# EAGLE schematic elasticNode (EAGLE 8.2.0)

## Sheet 1 of 4
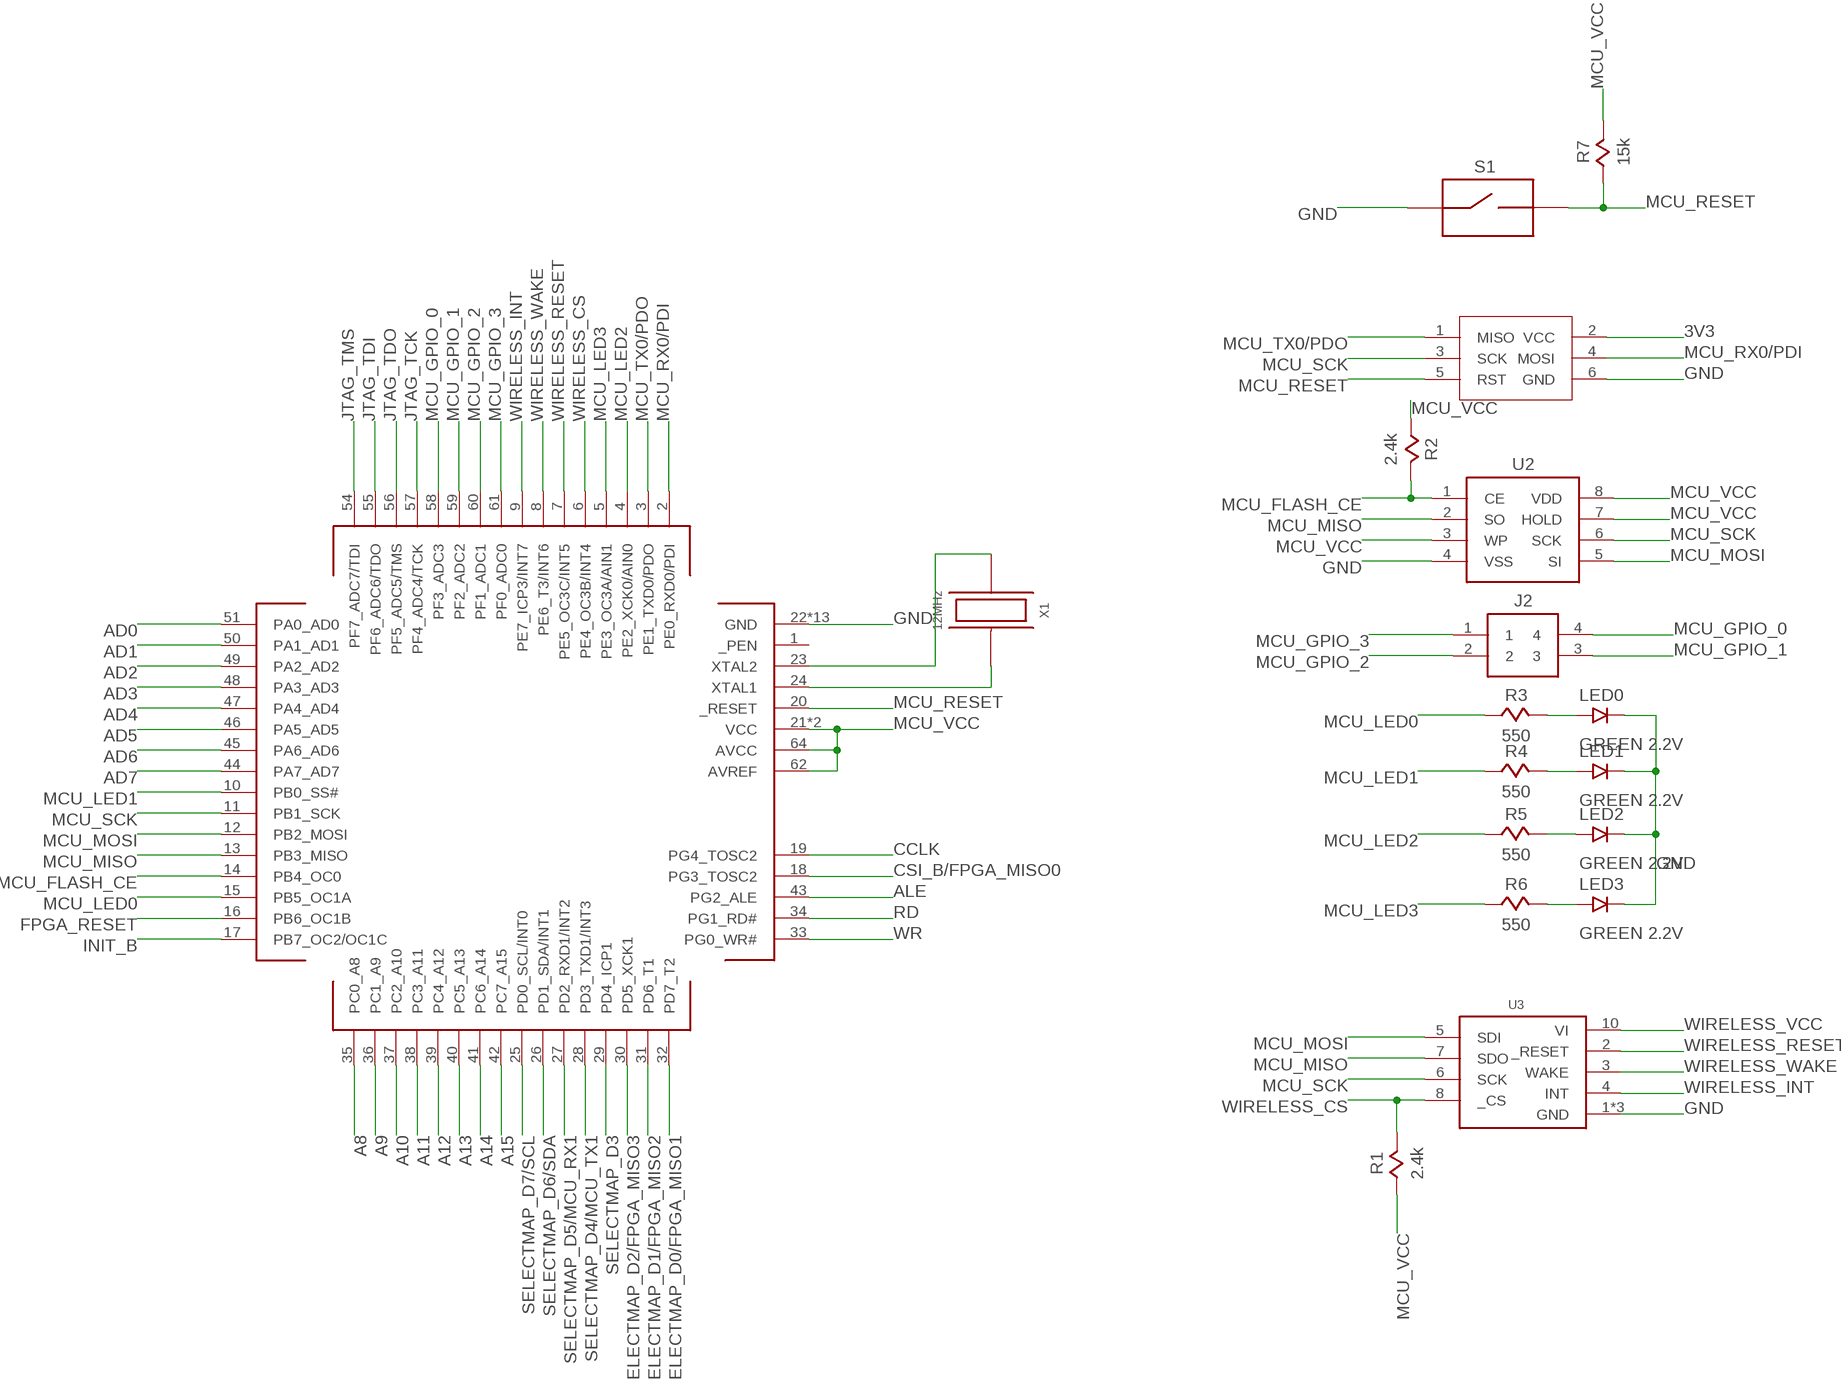
[diagram p0: schematic, sheet 1]

### Parts
J1  ISP_CONN_6PIN  [3X2_HEADER_SMT]
J2  FEMALE_HEADER_2X2  [2X2_HEADER]
LED0  GREEN 2.2V  LED  [0805]
LED1  GREEN 2.2V  LED  [0805]
LED2  GREEN 2.2V  LED  [0805]
LED3  GREEN 2.2V  LED  [0805]
R1  2.4k  RESISTOR  [0805]
R2  2.4k  RESISTOR  [0805]
R3  550  RESISTOR  [0805]
R4  550  RESISTOR  [0805]
R5  550  RESISTOR  [0805]
R6  550  RESISTOR  [0805]
R7  15k  RESISTOR  [0805]
S1  SPST_BUTTON2PIN_SMT  [SPST_2PIN_SMT]
U1  ATMEGA64AQFN  [QFN64]
U2  SST26VF032B  [SOIC8]
U3  MRF24J40MA  [MRF24J40MA]
X1  12MHz  QUARTZ  [3.2X2.5_OSC]

### Nets
3V3 [power]: J1.2(VCC) ; also sheet 2,3,4
A8: U1.35(PC0_A8) ; also sheet 2
A9: U1.36(PC1_A9) ; also sheet 2
A10: U1.37(PC2_A10) ; also sheet 2
A11: U1.38(PC3_A11) ; also sheet 2
A12: U1.39(PC4_A12) ; also sheet 2
A13: U1.40(PC5_A13) ; also sheet 2
A14: U1.41(PC6_A14) ; also sheet 2
A15: U1.42(PC7_A15) ; also sheet 2
AD0: U1.51(PA0_AD0) ; also sheet 2
AD1: U1.50(PA1_AD1) ; also sheet 2
AD2: U1.49(PA2_AD2) ; also sheet 2
AD3: U1.48(PA3_AD3) ; also sheet 2
AD4: U1.47(PA4_AD4) ; also sheet 2
AD5: U1.46(PA5_AD5) ; also sheet 2
AD6: U1.45(PA6_AD6) ; also sheet 2
AD7: U1.44(PA7_AD7) ; also sheet 2
ALE: U1.43(PG2_ALE) ; also sheet 2
CCLK: U1.19(PG4_TOSC2) ; also sheet 2
CSI_B/FPGA_MISO0: U1.18(PG3_TOSC2) ; also sheet 2
FPGA_RESET: U1.16(PB6_OC1B) ; also sheet 2
GND: J1.6(GND) LED0.2 LED1.2 LED2.2 LED3.2 S1.1 U1.22(GND) U1.53(GND) U1.63(GND) U1.PAD(GND) U1.VIA1(GND) U1.VIA2(GND) U1.VIA3(GND) U1.VIA4(GND) U1.VIA5(GND) U1.VIA6(GND) U1.VIA7(GND) U1.VIA8(GND) U1.VIA9(GND) U2.4(VSS) U3.1(GND) U3.11(GND) U3.12(GND) ; also sheet 2,3,4
INIT_B: U1.17(PB7_OC2/OC1C) ; also sheet 2
JTAG_TCK: U1.57(PF4_ADC4/TCK) ; also sheet 2
JTAG_TDI: U1.55(PF6_ADC6/TDO) ; also sheet 2
JTAG_TDO: U1.56(PF5_ADC5/TMS) ; also sheet 2
JTAG_TMS: U1.54(PF7_ADC7/TDI) ; also sheet 2
MCU_FLASH_CE: R2.2 U1.14(PB4_OC0) U2.1(CE)
MCU_GPIO_0: J2.4 U1.58(PF3_ADC3)
MCU_GPIO_1: J2.3 U1.59(PF2_ADC2)
MCU_GPIO_2: J2.2 U1.60(PF1_ADC1)
MCU_GPIO_3: J2.1 U1.61(PF0_ADC0)
MCU_LED0: R3.1 U1.15(PB5_OC1A)
MCU_LED1: R4.1 U1.10(PB0_SS#)
MCU_LED2: R5.1 U1.4(PE2_XCK0/AIN0)
MCU_LED3: R6.1 U1.5(PE3_OC3A/AIN1)
MCU_MISO: U1.13(PB3_MISO) U2.2(SO) U3.7(SDO)
MCU_MOSI: U1.12(PB2_MOSI) U2.5(SI) U3.5(SDI)
MCU_RESET: J1.5(RST) R7.1 S1.2 U1.20(_RESET)
MCU_RX0/PDI: J1.4(MOSI) U1.2(PE0_RXD0/PDI) ; also sheet 4
MCU_SCK: J1.3(SCK) U1.11(PB1_SCK) U2.6(SCK) U3.6(SCK)
MCU_TX0/PDO: J1.1(MISO) U1.3(PE1_TXD0/PDO) ; also sheet 4
MCU_VCC: R1.1 R2.1 R7.2 U1.21(VCC) U1.52(VCC) U1.62(AVREF) U1.64(AVCC) U2.3(WP) U2.7(HOLD) U2.8(VDD) ; also sheet 3
N$13: LED3.1 R6.2
N$15: LED2.1 R5.2
N$23: LED1.1 R4.2
N$24: LED0.1 R3.2
RD: U1.34(PG1_RD#) ; also sheet 2
SELECTMAP_D0/FPGA_MISO1: U1.32(PD7_T2) ; also sheet 2
SELECTMAP_D1/FPGA_MISO2: U1.31(PD6_T1) ; also sheet 2
SELECTMAP_D2/FPGA_MISO3: U1.30(PD5_XCK1) ; also sheet 2
SELECTMAP_D3: U1.29(PD4_ICP1) ; also sheet 2
SELECTMAP_D4/MCU_TX1: U1.28(PD3_TXD1/INT3) ; also sheet 2
SELECTMAP_D5/MCU_RX1: U1.27(PD2_RXD1/INT2) ; also sheet 2
SELECTMAP_D6/SDA: U1.26(PD1_SDA/INT1) ; also sheet 2,3
SELECTMAP_D7/SCL: U1.25(PD0_SCL/INT0) ; also sheet 2,3
WIRELESS_CS: R1.2 U1.6(PE4_OC3B/INT4) U3.8(_CS)
WIRELESS_INT: U1.9(PE7_ICP3/INT7) U3.4(INT)
WIRELESS_RESET: U1.7(PE5_OC3C/INT5) U3.2(_RESET)
WIRELESS_VCC [power]: U3.10(VI) ; also sheet 3
WIRELESS_WAKE: U1.8(PE6_T3/INT6) U3.3(WAKE)
WR: U1.33(PG0_WR#) ; also sheet 2
XTAL1: U1.24(XTAL1) X1.3
XTAL2: U1.23(XTAL2) X1.1
Unconnected: U1.1(_PEN)

## Sheet 2 of 4
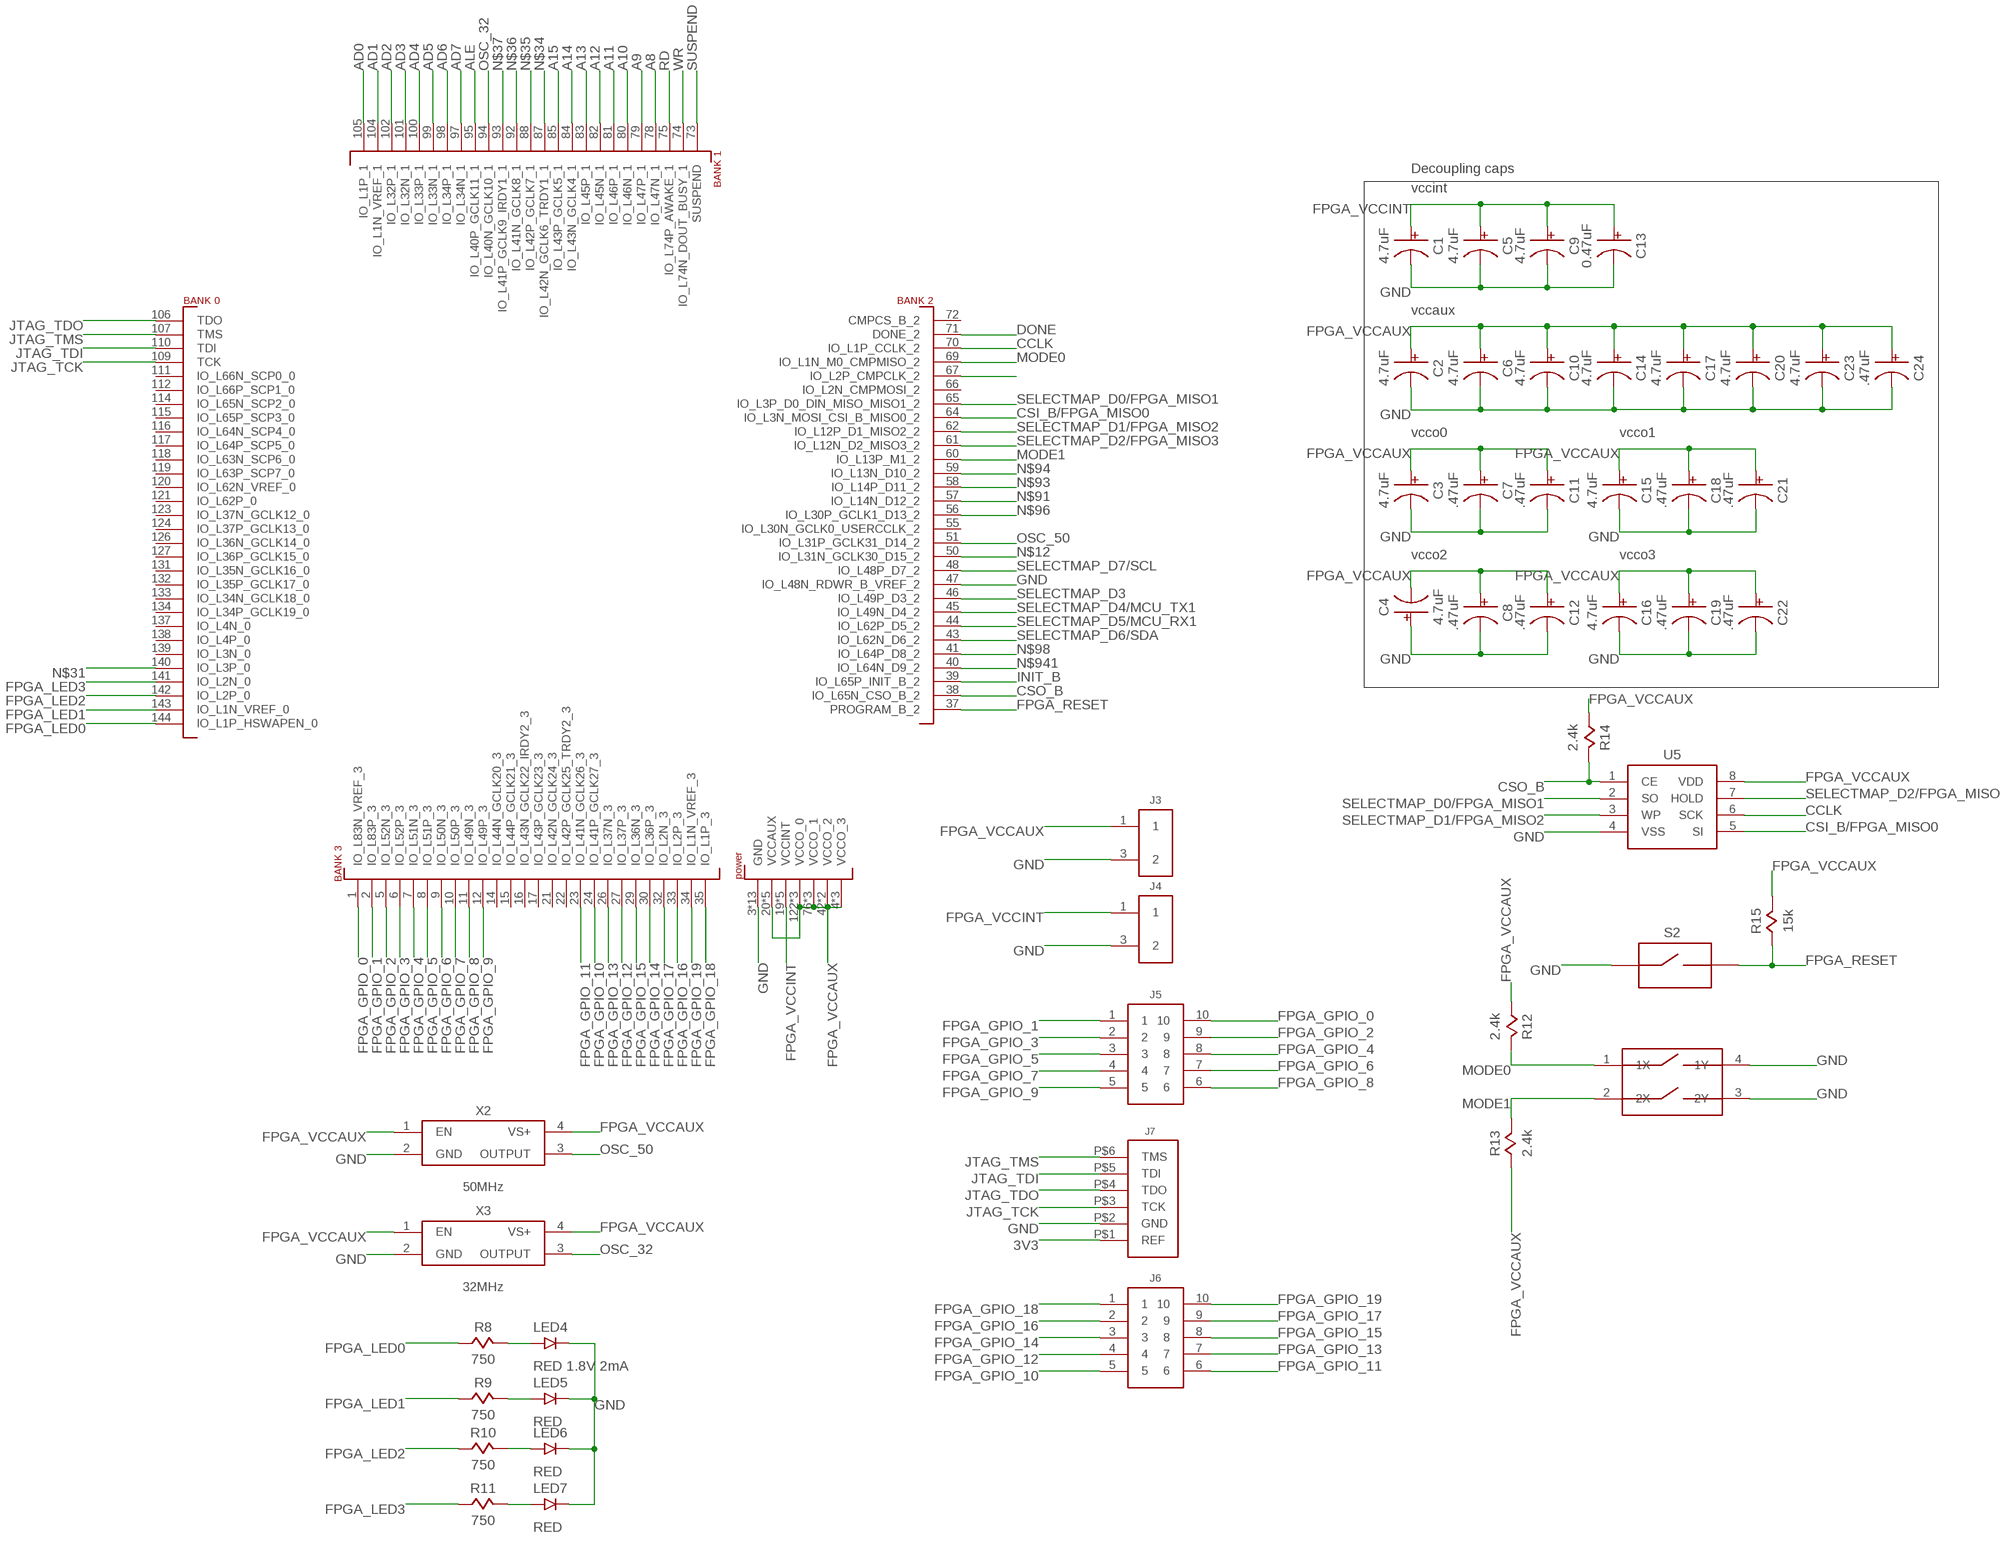
[diagram p1: schematic, sheet 2]

### Parts
C1  4.7uF  CAPACITOR0805  [0805]
C2  4.7uF  CAPACITOR0805  [0805]
C3  4.7uF  CAPACITOR0805  [0805]
C4  4.7uF  CAPACITOR0805  [0805]
C5  4.7uF  CAPACITOR0805  [0805]
C6  4.7uF  CAPACITOR0805  [0805]
C7  .47uF  CAPACITOR0402  [0402]
C8  .47uF  CAPACITOR0402  [0402]
C9  4.7uF  CAPACITOR0805  [0805]
C10  4.7uF  CAPACITOR0805  [0805]
C11  .47uF  CAPACITOR0402  [0402]
C12  .47uF  CAPACITOR0402  [0402]
C13  0.47uF  CAPACITOR0402  [0402]
C14  4.7uF  CAPACITOR0805  [0805]
C15  4.7uF  CAPACITOR0805  [0805]
C16  4.7uF  CAPACITOR0805  [0805]
C17  4.7uF  CAPACITOR0805  [0805]
C18  .47uF  CAPACITOR0402  [0402]
C19  .47uF  CAPACITOR0402  [0402]
C20  4.7uF  CAPACITOR0805  [0805]
C21  .47uF  CAPACITOR0402  [0402]
C22  .47uF  CAPACITOR0402  [0402]
C23  4.7uF  CAPACITOR0805  [0805]
C24  .47uF  CAPACITOR0805  [0805]
J3  FEMALE_HEADER_2X1  [2X1_HEADER]
J4  FEMALE_HEADER_2X1  [2X1_HEADER]
J5  FEMALE_HEADER_5X2  [5X2_HEADER]
J6  FEMALE_HEADER_5X2  [5X2_HEADER]
J7  JTAG_CONN_6PINTHT  [6X1_HEADER]
LED4  RED 1.8V 2mA  LED  [0805]
LED5  RED  LED  [0805]
LED6  RED  LED  [0805]
LED7  RED  LED  [0805]
R8  750  RESISTOR  [0805]
R9  750  RESISTOR  [0805]
R10  750  RESISTOR  [0805]
R11  750  RESISTOR  [0805]
R12  2.4k  RESISTOR  [0805]
R13  2.4k  RESISTOR  [0805]
R14  2.4k  RESISTOR  [0805]
R15  15k  RESISTOR  [0805]
S2  SPST_BUTTON2PIN_SMT  [SPST_2PIN_SMT]
S3  SPST_DIP_2SMT  [SPST_DIP2_SMT]
U4  SPARTAN6-LX9  [TQG144]
U5  SST26VF032B  [SOIC8]
X2  50MHz  OSCILLATOR3.2X2.5  [3.2X2.5_OSC]
X3  32MHz  OSCILLATOR3.2X2.5  [3.2X2.5_OSC]

### Nets
3V3 [power]: J7.P$1(REF) ; also sheet 1,3,4
A8: U4.78(IO_L47N_1) ; also sheet 1
A9: U4.79(IO_L47P_1) ; also sheet 1
A10: U4.80(IO_L46N_1) ; also sheet 1
A11: U4.81(IO_L46P_1) ; also sheet 1
A12: U4.82(IO_L45N_1) ; also sheet 1
A13: U4.83(IO_L45P_1) ; also sheet 1
A14: U4.84(IO_L43N_GCLK4_1) ; also sheet 1
A15: U4.85(IO_L43P_GCLK5_1) ; also sheet 1
AD0: U4.105(IO_L1P_1) ; also sheet 1
AD1: U4.104(IO_L1N_VREF_1) ; also sheet 1
AD2: U4.102(IO_L32P_1) ; also sheet 1
AD3: U4.101(IO_L32N_1) ; also sheet 1
AD4: U4.100(IO_L33P_1) ; also sheet 1
AD5: U4.99(IO_L33N_1) ; also sheet 1
AD6: U4.98(IO_L34P_1) ; also sheet 1
AD7: U4.97(IO_L34N_1) ; also sheet 1
ALE: U4.95(IO_L40P_GCLK11_1) ; also sheet 1
CCLK: U4.70(IO_L1P_CCLK_2) U5.6(SCK) ; also sheet 1
CSI_B/FPGA_MISO0: U4.64(IO_L3N_MOSI_CSI_B_MISO0_2) U5.5(SI) ; also sheet 1
CSO_B: R14.2 U4.38(IO_L65N_CSO_B_2) U5.1(CE)
DONE: U4.71(DONE_2)
FPGA_GPIO_0: J5.10 U4.1(IO_L83N_VREF_3)
FPGA_GPIO_1: J5.1 U4.2(IO_L83P_3)
FPGA_GPIO_2: J5.9 U4.5(IO_L52N_3)
FPGA_GPIO_3: J5.2 U4.6(IO_L52P_3)
FPGA_GPIO_4: J5.8 U4.7(IO_L51N_3)
FPGA_GPIO_5: J5.3 U4.8(IO_L51P_3)
FPGA_GPIO_6: J5.7 U4.9(IO_L50N_3)
FPGA_GPIO_7: J5.4 U4.10(IO_L50P_3)
FPGA_GPIO_8: J5.6 U4.11(IO_L49N_3)
FPGA_GPIO_9: J5.5 U4.12(IO_L49P_3)
FPGA_GPIO_10: J6.5 U4.24(IO_L41P_GCLK27_3)
FPGA_GPIO_11: J6.6 U4.23(IO_L41N_GCLK26_3)
FPGA_GPIO_12: J6.4 U4.27(IO_L37P_3)
FPGA_GPIO_13: J6.7 U4.26(IO_L37N_3)
FPGA_GPIO_14: J6.3 U4.30(IO_L36P_3)
FPGA_GPIO_15: J6.8 U4.29(IO_L36N_3)
FPGA_GPIO_16: J6.2 U4.33(IO_L2P_3)
FPGA_GPIO_17: J6.9 U4.32(IO_L2N_3)
FPGA_GPIO_18: J6.1 U4.35(IO_L1P_3)
FPGA_GPIO_19: J6.10 U4.34(IO_L1N_VREF_3)
FPGA_LED0: R8.1 U4.144(IO_L1P_HSWAPEN_0)
FPGA_LED1: R9.1 U4.143(IO_L1N_VREF_0)
FPGA_LED2: R10.1 U4.142(IO_L2P_0)
FPGA_LED3: R11.1 U4.141(IO_L2N_0)
FPGA_RESET: R15.1 S2.2 U4.37(PROGRAM_B_2) ; also sheet 1
FPGA_VCCAUX: C2.1 C3.1 C4.2 C6.1 C7.1 C8.1 C10.1 C11.1 C12.1 C14.1 C15.1 C16.1 C17.1 C18.1 C19.1 C20.1 C21.1 C22.1 C23.1 C24.1 J3.1 R12.1 R13.1 R14.1 R15.2 U4.4(VCCO_3) U4.18(VCCO_3) U4.20(VCCAUX) U4.31(VCCO_3) U4.36(VCCAUX) U4.42(VCCO_2) U4.53(VCCAUX) U4.63(VCCO_2) U4.76(VCCO_1) U4.86(VCCO_1) U4.90(VCCAUX) U4.103(VCCO_1) U4.122(VCCO_0) U4.125(VCCO_0) U4.129(VCCAUX) U4.135(VCCO_0) U5.8(VDD) X2.1(EN) X2.4(VS+) X3.1(EN) X3.4(VS+) ; also sheet 3
FPGA_VCCINT [power]: C1.1 C5.1 C9.1 C13.1 J4.1 U4.19(VCCINT) U4.28(VCCINT) U4.52(VCCINT) U4.89(VCCINT) U4.128(VCCINT) ; also sheet 3
GND: C1.2 C2.2 C3.2 C4.1 C5.2 C6.2 C7.2 C8.2 C9.2 C10.2 C11.2 C12.2 C13.2 C14.2 C15.2 C16.2 C17.2 C18.2 C19.2 C20.2 C21.2 C22.2 C23.2 C24.2 J3.3 J4.3 J7.P$2(GND) LED4.2 LED5.2 LED6.2 LED7.2 S2.1 S3.3(2Y) S3.4(1Y) U4.3(GND) U4.13(GND) U4.25(GND) U4.47(IO_L48N_RDWR_B_VREF_2) U4.49(GND) U4.54(GND) U4.68(GND) U4.77(GND) U4.91(GND) U4.96(GND) U4.108(GND) U4.113(GND) U4.130(GND) U4.136(GND) U5.4(VSS) X2.2(GND) X3.2(GND) ; also sheet 1,3,4
INIT_B: U4.39(IO_L65P_INIT_B_2) ; also sheet 1
JTAG_TCK: J7.P$3(TCK) U4.109(TCK) ; also sheet 1
JTAG_TDI: J7.P$5(TDI) U4.110(TDI) ; also sheet 1
JTAG_TDO: J7.P$4(TDO) U4.106(TDO) ; also sheet 1
JTAG_TMS: J7.P$6(TMS) U4.107(TMS) ; also sheet 1
MODE0: R12.2 S3.1(1X) U4.69(IO_L1N_M0_CMPMISO_2)
MODE1: R13.2 S3.2(2X) U4.60(IO_L13P_M1_2)
N$9: U4.67(IO_L2P_CMPCLK_2)
N$12: U4.50(IO_L31N_GCLK30_D15_2)
N$25: LED7.1 R11.2
N$27: LED6.1 R10.2
N$29: LED5.1 R9.2
N$30: LED4.1 R8.2
N$31: U4.140(IO_L3P_0)
N$34: U4.87(IO_L42N_GCLK6_TRDY1_1)
N$35: U4.88(IO_L42P_GCLK7_1)
N$36: U4.92(IO_L41N_GCLK8_1)
N$37: U4.93(IO_L41P_GCLK9_IRDY1_1)
N$91: U4.57(IO_L14N_D12_2)
N$93: U4.58(IO_L14P_D11_2)
N$94: U4.59(IO_L13N_D10_2)
N$96: U4.56(IO_L30P_GCLK1_D13_2)
N$98: U4.41(IO_L64P_D8_2)
N$941: U4.40(IO_L64N_D9_2)
OSC_32: U4.94(IO_L40N_GCLK10_1) X3.3(OUTPUT)
OSC_50: U4.51(IO_L31P_GCLK31_D14_2) X2.3(OUTPUT)
RD: U4.75(IO_L74P_AWAKE_1) ; also sheet 1
SELECTMAP_D0/FPGA_MISO1: U4.65(IO_L3P_D0_DIN_MISO_MISO1_2) U5.2(SO) ; also sheet 1
SELECTMAP_D1/FPGA_MISO2: U4.62(IO_L12P_D1_MISO2_2) U5.3(WP) ; also sheet 1
SELECTMAP_D2/FPGA_MISO3: U4.61(IO_L12N_D2_MISO3_2) U5.7(HOLD) ; also sheet 1
SELECTMAP_D3: U4.46(IO_L49P_D3_2) ; also sheet 1
SELECTMAP_D4/MCU_TX1: U4.45(IO_L49N_D4_2) ; also sheet 1
SELECTMAP_D5/MCU_RX1: U4.44(IO_L62P_D5_2) ; also sheet 1
SELECTMAP_D6/SDA: U4.43(IO_L62N_D6_2) ; also sheet 1,3
SELECTMAP_D7/SCL: U4.48(IO_L48P_D7_2) ; also sheet 1,3
SUSPEND: U4.73(SUSPEND)
WR: U4.74(IO_L74N_DOUT_BUSY_1) ; also sheet 1
Unconnected: U4.14(IO_L44N_GCLK20_3) U4.15(IO_L44P_GCLK21_3) U4.16(IO_L43N_GCLK22_IRDY2_3) U4.17(IO_L43P_GCLK23_3) U4.21(IO_L42N_GCLK24_3) U4.22(IO_L42P_GCLK25_TRDY2_3) U4.55(IO_L30N_GCLK0_USERCCLK_2) U4.66(IO_L2N_CMPMOSI_2) U4.72(CMPCS_B_2) U4.111(IO_L66N_SCP0_0) U4.112(IO_L66P_SCP1_0) U4.114(IO_L65N_SCP2_0) U4.115(IO_L65P_SCP3_0) U4.116(IO_L64N_SCP4_0) U4.117(IO_L64P_SCP5_0) U4.118(IO_L63N_SCP6_0) U4.119(IO_L63P_SCP7_0) U4.120(IO_L62N_VREF_0) U4.121(IO_L62P_0) U4.123(IO_L37N_GCLK12_0) U4.124(IO_L37P_GCLK13_0) U4.126(IO_L36N_GCLK14_0) U4.127(IO_L36P_GCLK15_0) U4.131(IO_L35N_GCLK16_0) U4.132(IO_L35P_GCLK17_0) U4.133(IO_L34N_GCLK18_0) U4.134(IO_L34P_GCLK19_0) U4.137(IO_L4N_0) U4.138(IO_L4P_0) U4.139(IO_L3N_0)

### Notes on the sheet
- Decoupling caps
- vccint
- vccaux
- vcco0 | vcco1
- vcco2 | vcco3

## Sheet 3 of 4
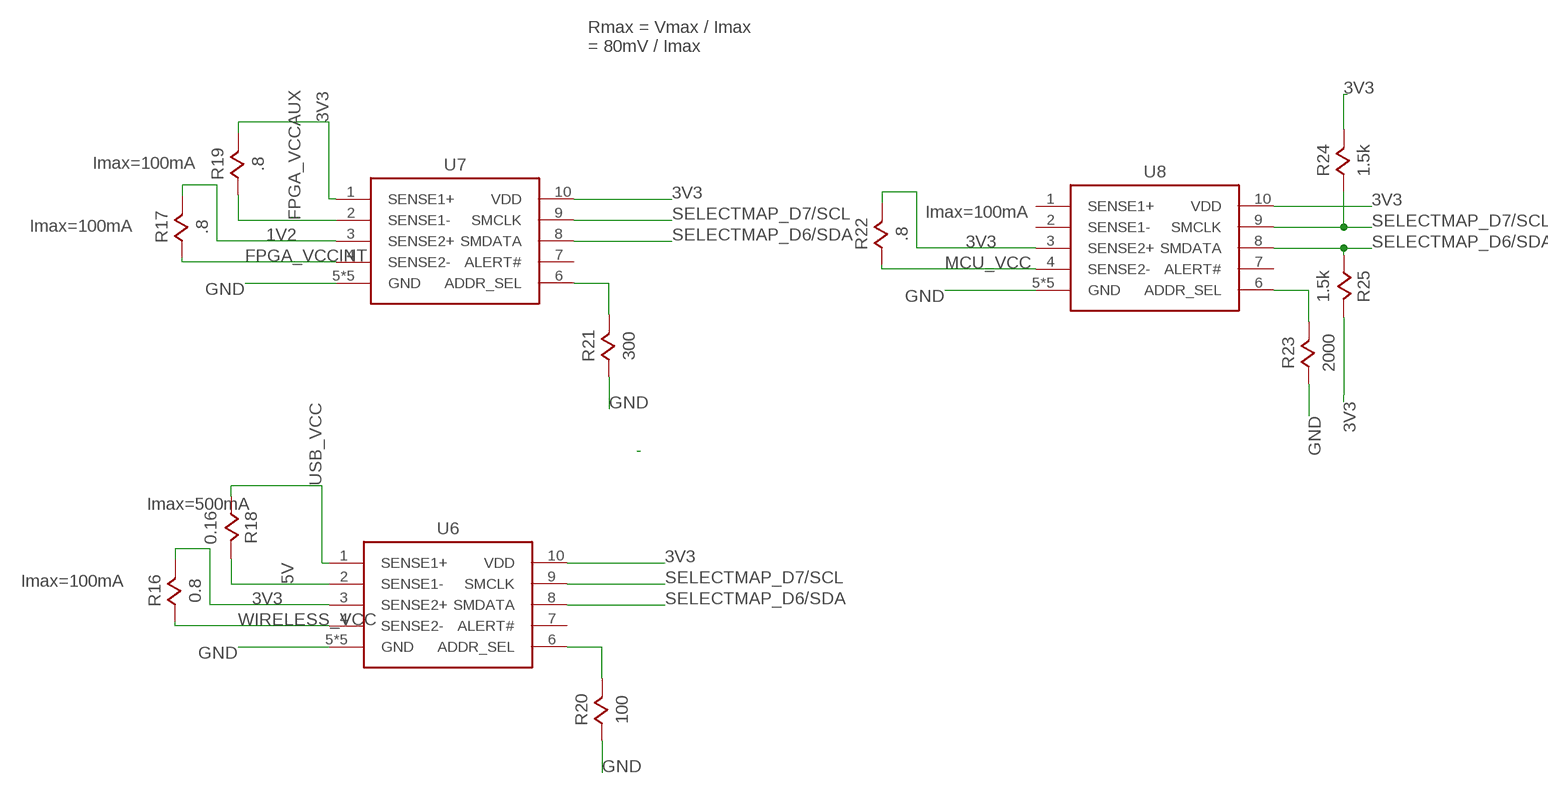
[diagram p2: schematic, sheet 3]

### Parts
R16  0.8  RESISTOR  [0805]
R17  .8  RESISTOR  [0805]
R18  0.16  RESISTOR  [0805]
R19  .8  RESISTOR  [0805]
R20  100  RESISTOR  [0805]
R21  300  RESISTOR  [0805]
R22  .8  RESISTOR  [0805]
R23  2000  RESISTOR  [0805]
R24  1.5k  RESISTOR  [0805]
R25  1.5k  RESISTOR  [0805]
U6  PAC1720  [VDFN10]
U7  PAC1720  [VDFN10]
U8  PAC1720  [VDFN10]

### Nets
1V2 [power]: R17.2 U7.3(SENSE2+) ; also sheet 4
3V3 [power]: R16.2 R19.2 R22.2 R24.2 R25.2 U6.3(SENSE2+) U6.10(VDD) U7.1(SENSE1+) U7.10(VDD) U8.3(SENSE2+) U8.10(VDD) ; also sheet 1,2,4
5V [power]: R18.2 U6.2(SENSE1-) ; also sheet 4
FPGA_VCCAUX: R19.1 U7.2(SENSE1-) ; also sheet 2
FPGA_VCCINT [power]: R17.1 U7.4(SENSE2-) ; also sheet 2
GND: R20.1 R21.1 R23.1 U6.5(GND) U6.P$1(GND) U6.P$2(GND) U6.P$3(GND) U6.P$4(GND) U7.5(GND) U7.P$1(GND) U7.P$2(GND) U7.P$3(GND) U7.P$4(GND) U8.5(GND) U8.P$1(GND) U8.P$2(GND) U8.P$3(GND) U8.P$4(GND) ; also sheet 1,2,4
MCU_VCC: R22.1 U8.4(SENSE2-) ; also sheet 1
N$16: R23.2 U8.6(ADDR_SEL)
N$28: R21.2 U7.6(ADDR_SEL)
N$32: R20.2 U6.6(ADDR_SEL)
SELECTMAP_D6/SDA: R25.1 U6.8(SMDATA) U7.8(SMDATA) U8.8(SMDATA) ; also sheet 1,2
SELECTMAP_D7/SCL: R24.1 U6.9(SMCLK) U7.9(SMCLK) U8.9(SMCLK) ; also sheet 1,2
USB_VCC: R18.1 U6.1(SENSE1+) ; also sheet 4
WIRELESS_VCC [power]: R16.1 U6.4(SENSE2-) ; also sheet 1
Unconnected: U6.7(ALERT#) U7.7(ALERT#) U8.1(SENSE1+) U8.2(SENSE1-) U8.7(ALERT#)

### Notes on the sheet
- Rmax = Vmax / Imax
  = 80mV / Imax
- Imax=100mA
- Imax=100mA
- Imax=100mA
- Imax=500mA
- Imax=100mA

## Sheet 4 of 4
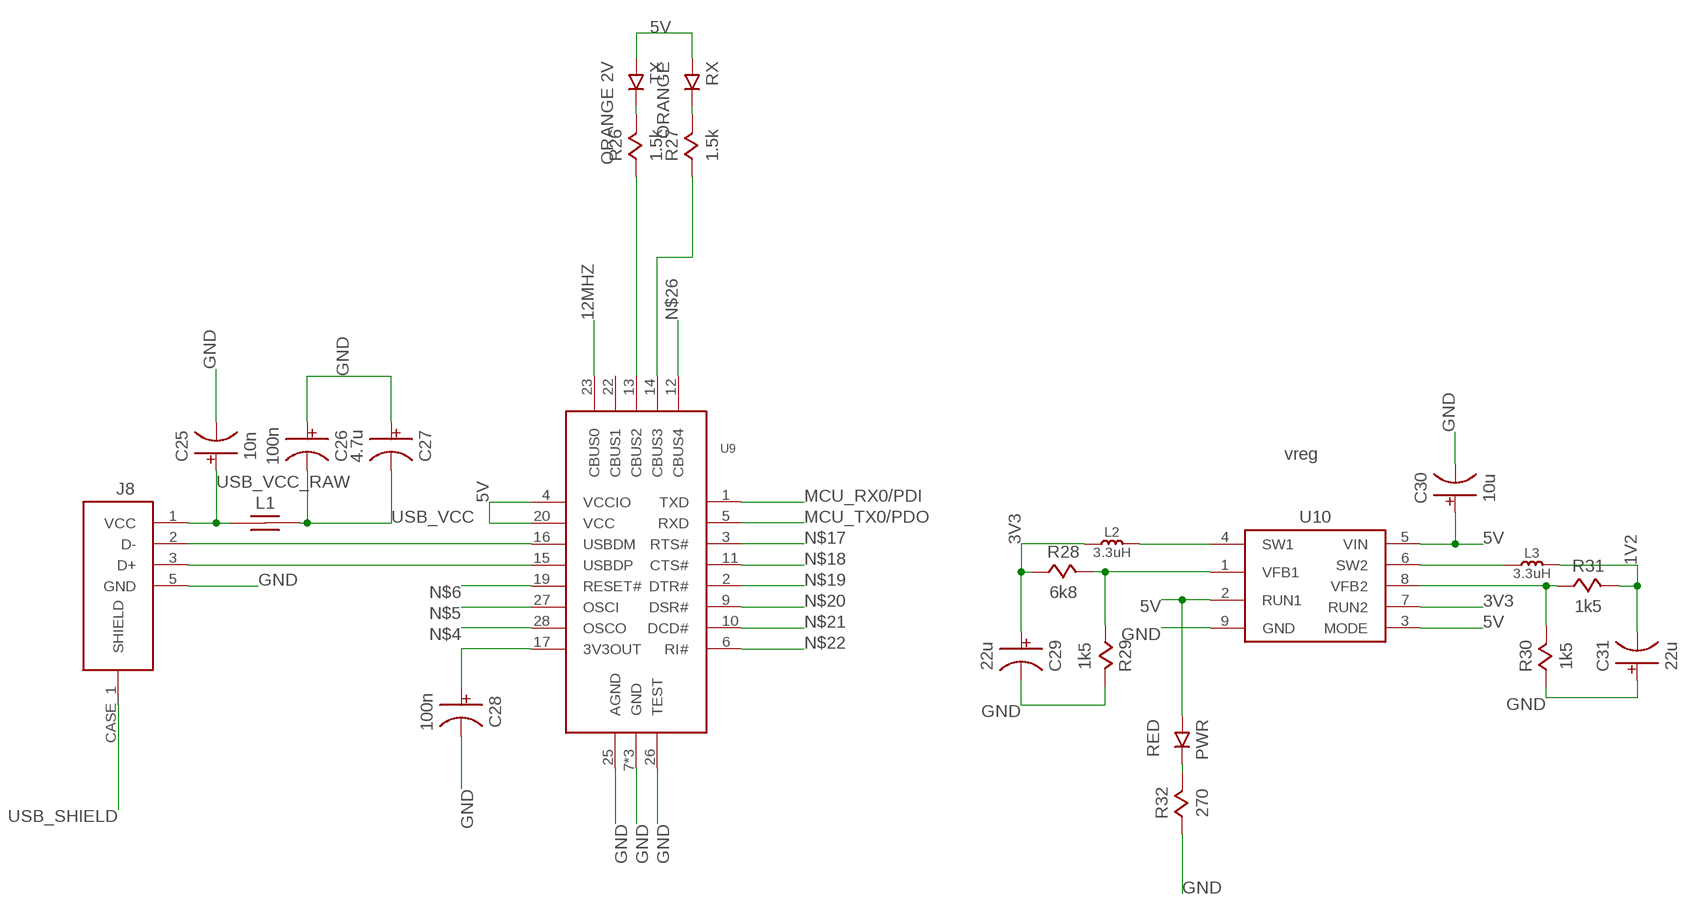
[diagram p3: schematic, sheet 4]

### Parts
C25  10n  CAPACITOR0805  [0805]
C26  100n  CAPACITOR0805  [0805]
C27  4.7u  CAPACITOR0805  [0805]
C28  100n  CAPACITOR0805  [0805]
C29  22u  CAPACITOR0805  [0805]
C30  10u  CAPACITOR0805  [0805]
C31  22u  CAPACITOR0805  [0805]
J8  USB_CONNSMT  [USB_MICRO_B_SMT]
L1  40Ohm 1.5A  FERRITE_BEAD  [0805]
L2  3.3uH  INDUCTOR  [0805]
L3  3.3uH  INDUCTOR  [0805]
PWR  RED  LED  [0805]
R26  1.5k  RESISTOR  [0805]
R27  1.5k  RESISTOR  [0805]
R28  6k8  RESISTOR  [0805]
R29  1k5  RESISTOR  [0805]
R30  1k5  RESISTOR  [0805]
R31  1k5  RESISTOR  [0805]
R32  270  RESISTOR  [0805]
RX  ORANGE  LED  [0805]
TX  ORANGE 2V  LED  [0805]
U9  FT232RSSOP28  [SSOP28]
U10  LTC3419DFN  [DFN8]

### Nets
1V2 [power]: C31.2 L3.2 R31.2 ; also sheet 3
3V3 [power]: C29.1 L2.1 R28.1 U10.7(RUN2) ; also sheet 1,2,3
5V [power]: C30.1 PWR.1 RX.1 TX.1 U9.4(VCCIO) U9.20(VCC) U10.2(RUN1) U10.3(MODE) U10.5(VIN) ; also sheet 3
12MHZ: U9.23(CBUS0)
FTDI_RXLED: R27.1 U9.14(CBUS3)
GND: C25.2 C26.1 C27.1 C28.2 C29.2 C30.2 C31.1 J8.5(GND) R29.2 R30.1 R32.1 U9.7(GND) U9.18(GND) U9.21(GND) U9.25(AGND) U9.26(TEST) U10.9(GND) ; also sheet 1,2,3
MCU_RX0/PDI: U9.1(TXD) ; also sheet 1
MCU_TX0/PDO: U9.5(RXD) ; also sheet 1
N$1: L2.2 U10.4(SW1)
N$2: R28.2 R29.1 U10.1(VFB1)
N$3: C28.1 U9.17(3V3OUT)
N$4: U9.28(OSCO)
N$5: U9.27(OSCI)
N$6: U9.19(RESET#)
N$7: R30.2 R31.1 U10.8(VFB2)
N$8: L3.1 U10.6(SW2)
N$10: R26.1 U9.13(CBUS2)
N$11: R26.2 TX.2
N$14: R27.2 RX.2
N$17: U9.3(RTS#)
N$18: U9.11(CTS#)
N$19: U9.2(DTR#)
N$20: U9.9(DSR#)
N$21: U9.10(DCD#)
N$22: U9.6(RI#)
N$26: U9.12(CBUS4)
N$41: PWR.2 R32.2
USB_SHIELD: J8.CASE_1(SHIELD)
USB_VCC: C26.2 C27.2 L1.2 ; also sheet 3
USB_VCC_RAW: C25.1 J8.1(VCC) L1.1
USBD+: J8.3(D+) U9.15(USBDP)
USBD-: J8.2(D-) U9.16(USBDM)
Unconnected: U9.22(CBUS1)

### Notes on the sheet
- vreg

## Library data of the parts
C1-C31 = passive:CAPACITOR
J1 = connectors:ISP_CONN_6PIN
J2 = connectors:FEMALE_HEADER_2X2
J3 J4 = connectors:FEMALE_HEADER_2X1
J5 J6 = connectors:FEMALE_HEADER_5X2
J7 = connectors:JTAG_CONN_6PIN
J8 = connectors:USB_CONN
L1 = passive:FERRITE_BEAD
L2 L3 = passive:INDUCTOR
LED0 LED1-LED7 PWR RX TX = opto:LED
R1-R32 = passive:RESISTOR
S1 S2 = connectors:SPST_BUTTON
S3 = connectors:SPST_DIP_2
U1 = ic:ATMEGA64A
U2 U5 = ic:SST26VF032B
U3 = wireless:MRF24J40MA
U4 = fpga:SPARTAN6-LX9
U6-U8 = sensors:PAC1720
U9 = ic:FT232R
U10 = power:LTC3419
X1 = passive:QUARTZ
X2 X3 = passive:OSCILLATOR